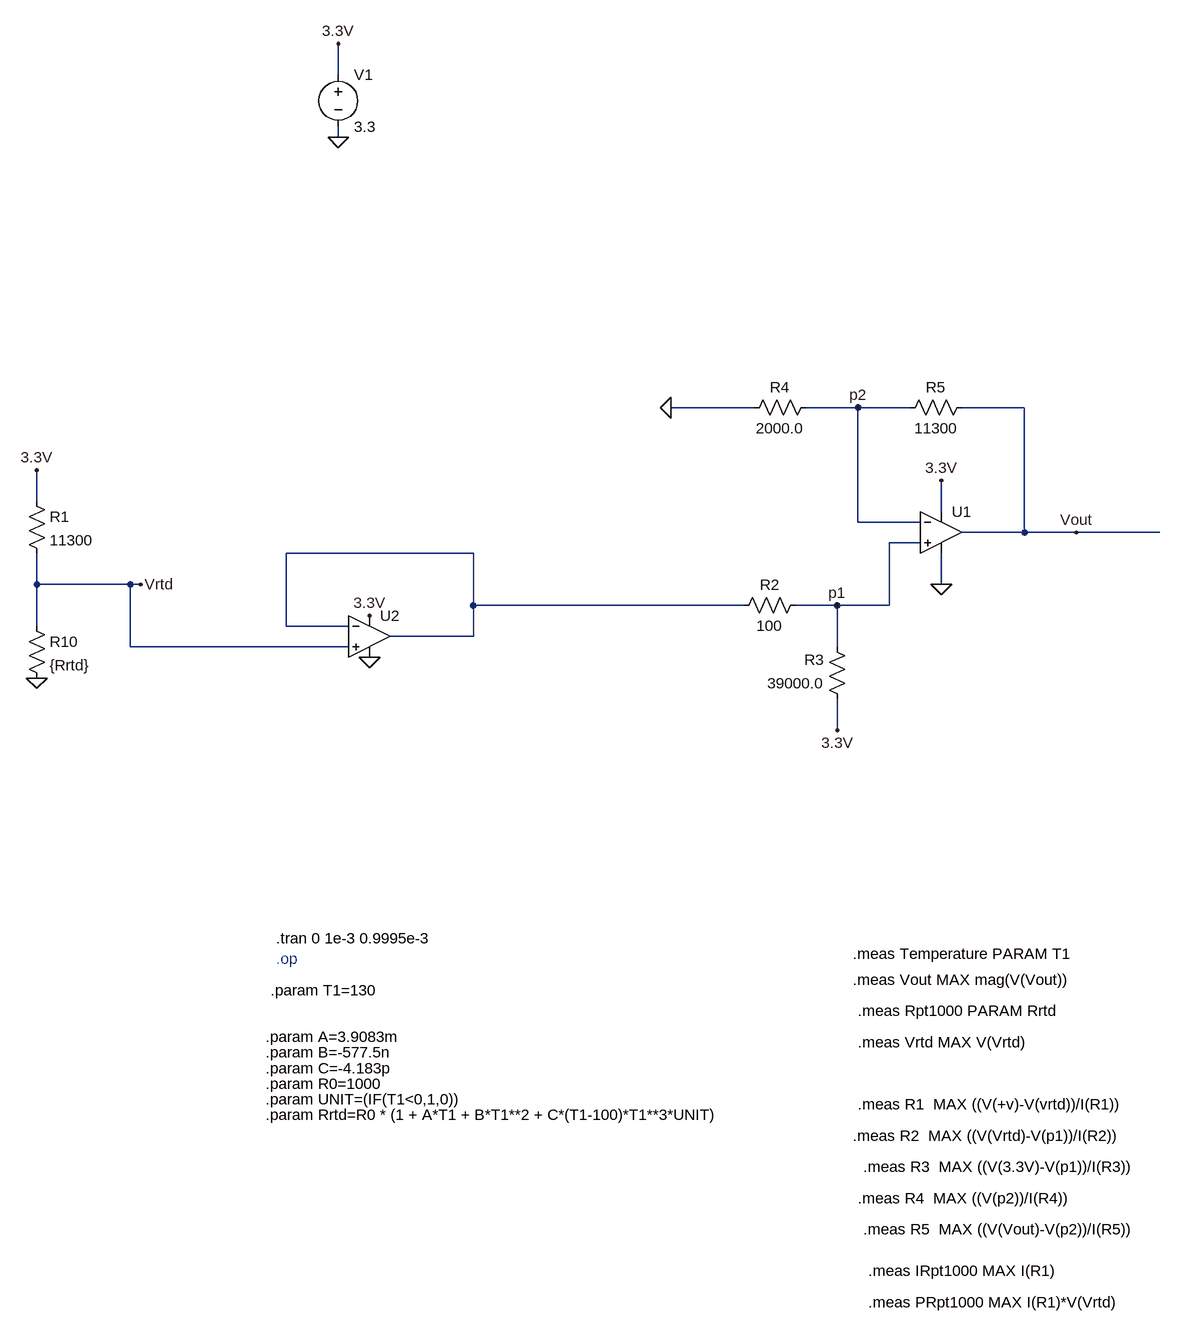
[diagram p0: schematic PT1000_circuit_1.asc]
PT1000_circuit_1.asc, the LTspice schematic file:
Version 4.1
SHEET 1 1540 1652
WIRE -1248 -816 -1248 -864
WIRE -1248 -720 -1248 -736
WIRE -608 -304 -736 -304
WIRE -448 -304 -528 -304
WIRE -368 -304 -448 -304
WIRE -192 -304 -288 -304
WIRE -1712 -160 -1712 -208
WIRE -320 -144 -320 -192
WIRE -448 -128 -448 -304
WIRE -352 -128 -448 -128
WIRE -192 -112 -192 -304
WIRE -192 -112 -288 -112
WIRE -112 -112 -192 -112
WIRE 16 -112 -112 -112
WIRE -352 -96 -400 -96
WIRE -1040 -80 -1328 -80
WIRE -1712 -32 -1712 -80
WIRE -1568 -32 -1712 -32
WIRE -1552 -32 -1568 -32
WIRE -320 -32 -320 -80
WIRE -1040 0 -1040 -80
WIRE -624 0 -1040 0
WIRE -480 0 -544 0
WIRE -400 0 -400 -96
WIRE -400 0 -480 0
WIRE -1712 32 -1712 -32
WIRE -1328 32 -1328 -80
WIRE -1232 32 -1328 32
WIRE -1040 48 -1040 0
WIRE -1040 48 -1168 48
WIRE -1568 64 -1568 -32
WIRE -1232 64 -1568 64
WIRE -480 64 -480 0
WIRE -480 192 -480 144
FLAG -1712 112 0
FLAG -1552 -32 Vrtd
FLAG -112 -112 Vout
FLAG -1248 -720 0
FLAG -1248 -864 3.3V
FLAG -1712 -208 3.3V
FLAG -480 192 3.3V
FLAG -320 -32 0
FLAG -736 -304 0
FLAG -480 0 p1
FLAG -448 -304 p2
FLAG -320 -192 3.3V
FLAG -1200 16 3.3V
FLAG -1200 80 0
SYMBOL res -1728 -176 R0
SYMATTR InstName R1
SYMATTR Value 11300
SYMBOL res -272 -320 R90
WINDOW 0 0 56 VBottom 2
WINDOW 3 32 56 VTop 2
SYMATTR InstName R5
SYMATTR Value 11300
SYMBOL OpAmps\\UniversalOpAmp -320 -112 R0
SYMATTR InstName U1
SYMBOL res -1728 16 R0
SYMATTR InstName R10
SYMATTR Value {Rrtd}
SYMBOL voltage -1248 -832 R0
WINDOW 123 0 0 Left 0
WINDOW 39 0 0 Left 0
SYMATTR InstName V1
SYMATTR Value 3.3
SYMBOL res -464 160 R180
WINDOW 0 36 76 Left 2
WINDOW 3 36 40 Left 2
SYMATTR InstName R3
SYMATTR Value 39000.0
SYMBOL res -528 -16 R90
WINDOW 0 0 56 VBottom 2
WINDOW 3 32 56 VTop 2
SYMATTR InstName R2
SYMATTR Value 100
SYMBOL res -512 -320 R90
WINDOW 0 0 56 VBottom 2
WINDOW 3 32 56 VTop 2
SYMATTR InstName R4
SYMATTR Value 2000.0
SYMBOL OpAmps\\UniversalOpAmp -1200 48 R0
SYMATTR InstName U2
TEXT -1344 512 Left 2 !.tran 0 1e-3 0.9995e-3
TEXT -1344 544 Left 2 ;.op
TEXT -1360 664 Left 2 !.param A=3.9083m
TEXT -1360 688 Left 2 !.param B=-577.5n
TEXT -1360 712 Left 2 !.param C=-4.183p
TEXT -1360 736 Left 2 !.param R0=1000
TEXT -1360 760 Left 2 !.param UNIT=(IF(T1<0,1,0))
TEXT -1360 784 Left 2 !.param Rrtd=R0 * (1 + A*T1 + B*T1**2 + C*(T1-100)*T1**3*UNIT)
TEXT -456 536 Left 2 !.meas Temperature PARAM T1
TEXT -456 576 Left 2 !.meas Vout MAX mag(V(Vout))
TEXT -448 624 Left 2 !.meas Rpt1000 PARAM Rrtd
TEXT -448 672 Left 2 !.meas Vrtd MAX V(Vrtd)
TEXT -1352 592 Left 2 !.param T1=130
TEXT -448 768 Left 2 !.meas R1  MAX ((V(+v)-V(vrtd))/I(R1))
TEXT -432 1024 Left 2 !.meas IRpt1000 MAX I(R1)
TEXT -432 1072 Left 2 !.meas PRpt1000 MAX I(R1)*V(Vrtd)
TEXT -456 816 Left 2 !.meas R2  MAX ((V(Vrtd)-V(p1))/I(R2))
TEXT -448 912 Left 2 !.meas R4  MAX ((V(p2))/I(R4))
TEXT -440 864 Left 2 !.meas R3  MAX ((V(3.3V)-V(p1))/I(R3))
TEXT -440 960 Left 2 !.meas R5  MAX ((V(Vout)-V(p2))/I(R5))

The netlist it stands for:
* PT1000_circuit_1.asc
R1 3.3V Vrtd 11300
R5 Vout p2 11300
X§U1 p1 p2 3.3V 0 Vout level1 Avol=1Meg GBW=10Meg Vos=0 En=0 Enk=0 In=0 Ink=0 Rin=500Meg  ; pins In+ In- V+ V- OUT
R10 Vrtd 0 {Rrtd}
V1 3.3V 0 3.3
R3 3.3V p1 39000.0
R2 p1 N001 100
R4 p2 0 2000.0
X§U2 Vrtd N001 3.3V 0 N001 level1 Avol=1Meg GBW=10Meg Vos=0 En=0 Enk=0 In=0 Ink=0 Rin=500Meg  ; pins In+ In- V+ V- OUT
.tran 0 1e-3 0.9995e-3
* .op
.param A=3.9083m
.param B=-577.5n
.param C=-4.183p
.param R0=1000
.param UNIT=(IF(T1<0,1,0))
.param Rrtd=R0 * (1 + A*T1 + B*T1**2 + C*(T1-100)*T1**3*UNIT)
.meas Temperature PARAM T1
.meas Vout MAX mag(V(Vout))
.meas Rpt1000 PARAM Rrtd
.meas Vrtd MAX V(Vrtd)
.param T1=130
.meas R1  MAX ((V(+v)-V(vrtd))/I(R1))
.meas IRpt1000 MAX I(R1)
.meas PRpt1000 MAX I(R1)*V(Vrtd)
.meas R2  MAX ((V(Vrtd)-V(p1))/I(R2))
.meas R4  MAX ((V(p2))/I(R4))
.meas R3  MAX ((V(3.3V)-V(p1))/I(R3))
.meas R5  MAX ((V(Vout)-V(p2))/I(R5))
.lib UniversalOpAmp1.lib
.backanno
.end